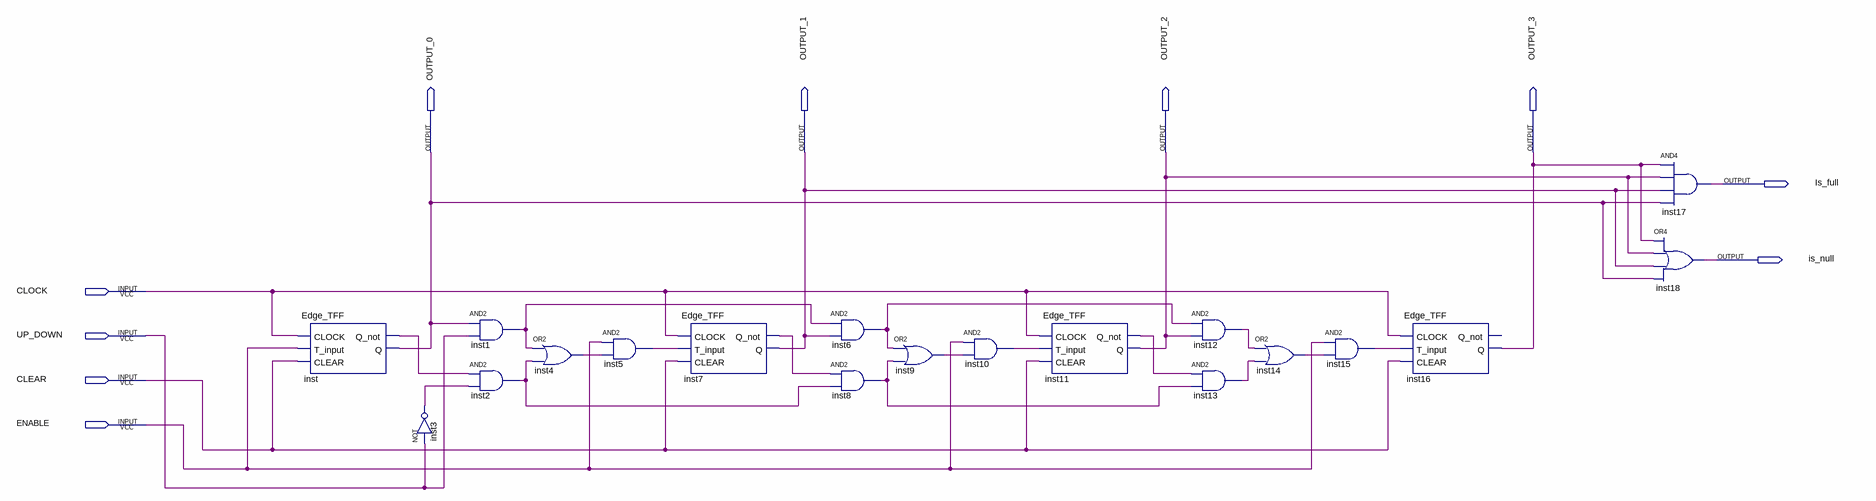
[diagram p0: schematic sheet]
// Quartus schematic Counter.bdf as structural Verilog: 19 symbols, 10 pins
module Counter (
  input  CLOCK,
  input  UP_DOWN,
  input  CLEAR,
  input  ENABLE,
  output OUTPUT_0,
  output OUTPUT_1,
  output OUTPUT_2,
  output OUTPUT_3,
  output Is_full,
  output is_null
);

  wire inst1_out, inst2_out, inst3_out, inst4_out, inst5_out, inst6_out, inst7_q_not, inst8_out, inst9_out,
       inst10_out, inst11_q_not, inst12_out, inst13_out, inst14_out, inst15_out, inst_q_not;

  Edge_TFF inst (.CLOCK(CLOCK), .T_input(ENABLE), .CLEAR(CLEAR), .Q_not(inst_q_not), .Q(OUTPUT_0));
  not inst3 (inst3_out, UP_DOWN);
  and inst1 (inst1_out, OUTPUT_0, UP_DOWN);
  and inst2 (inst2_out, inst_q_not, inst3_out);
  or inst4 (inst4_out, inst1_out, inst2_out);
  and inst5 (inst5_out, ENABLE, inst4_out);
  Edge_TFF inst7 (.CLOCK(CLOCK), .T_input(inst5_out), .CLEAR(CLEAR), .Q_not(inst7_q_not), .Q(OUTPUT_1));
  and inst6 (inst6_out, inst1_out, OUTPUT_1);
  and inst8 (inst8_out, inst7_q_not, inst2_out);
  or inst9 (inst9_out, inst6_out, inst8_out);
  and inst10 (inst10_out, ENABLE, inst9_out);
  Edge_TFF inst11 (.CLOCK(CLOCK), .T_input(inst10_out), .CLEAR(CLEAR), .Q_not(inst11_q_not), .Q(OUTPUT_2));
  and inst12 (inst12_out, inst6_out, OUTPUT_2);
  and inst13 (inst13_out, inst11_q_not, inst8_out);
  or inst14 (inst14_out, inst12_out, inst13_out);
  and inst15 (inst15_out, ENABLE, inst14_out);
  Edge_TFF inst16 (.CLOCK(CLOCK), .T_input(inst15_out), .CLEAR(CLEAR), .Q(OUTPUT_3));  // open: Q_not
  and inst17 (Is_full, OUTPUT_3, OUTPUT_2, OUTPUT_1, OUTPUT_0);
  or inst18 (is_null, OUTPUT_3, OUTPUT_2, OUTPUT_1, OUTPUT_0);
endmodule
